# Altium schematic sheet Power.SchDoc
size A4; SheetNumber: 3; SheetTotal: 5
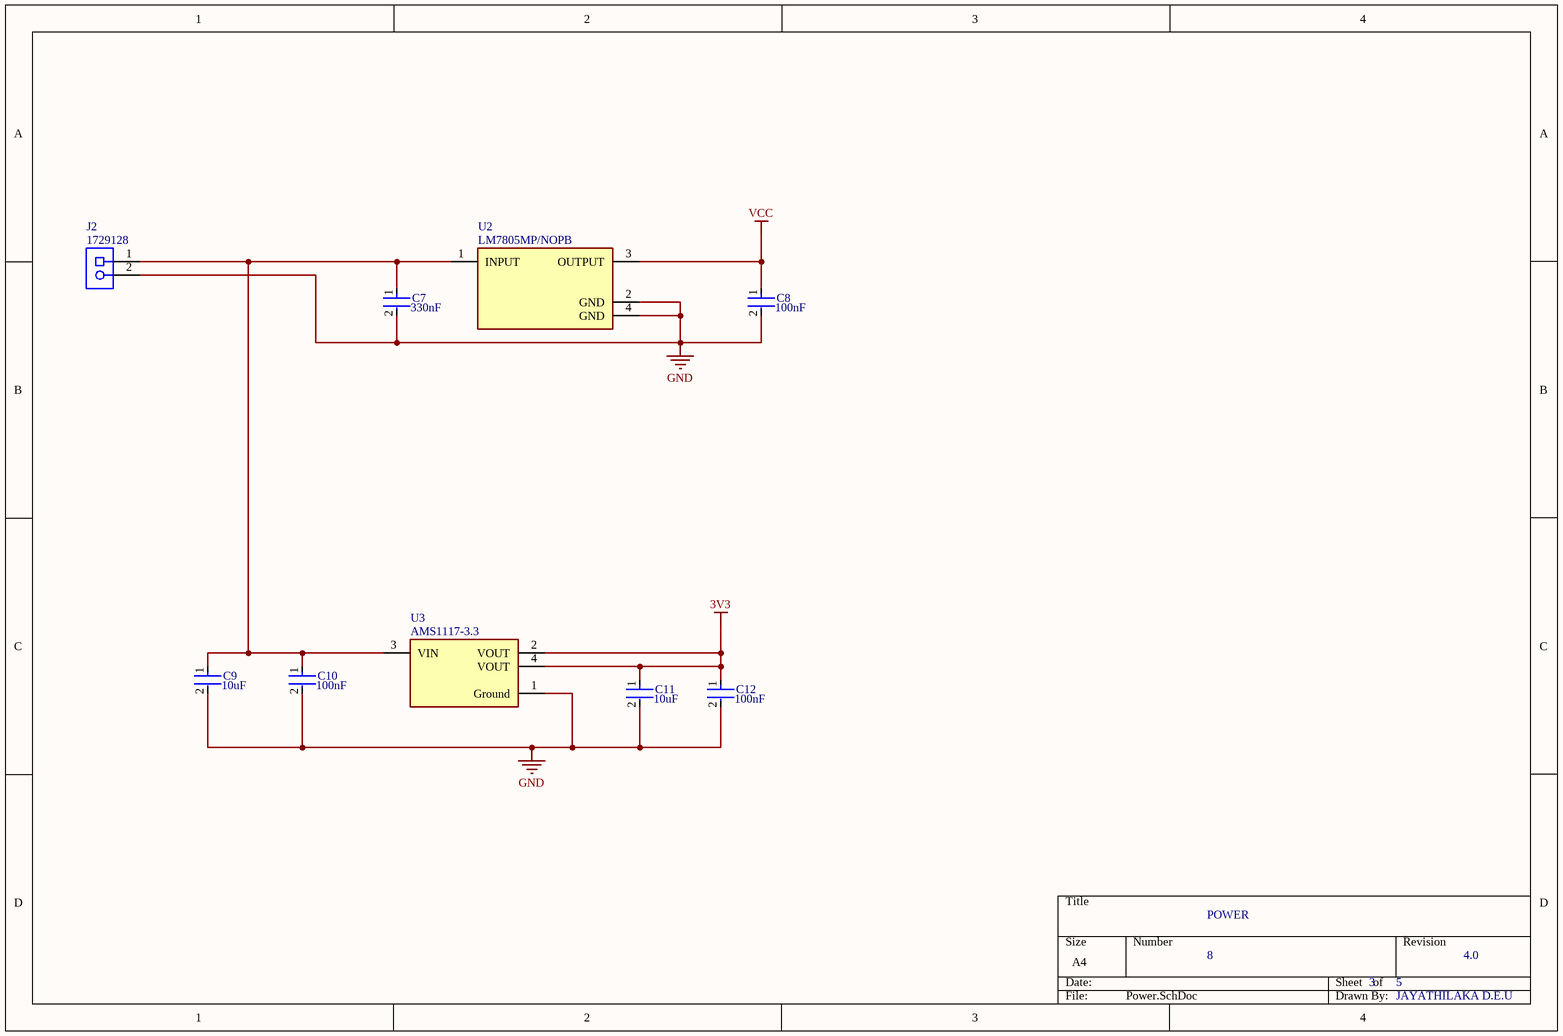
[diagram p0: Power.SchDoc]

## Parts
C7  value 330nF  [FP-CC1206-0_3-1_8-MFG]  (hidden comment: CC1206KKX7R0BB334)
C8  Capacitance: 100nF  [FP-GRM31C-0_2-e0_3_0_8-IPC_B]  (hidden comment: GRM31C5C1H104JA01L)
C9  value 10uF  [FP-CL31B106KBHNNNE-MFG]  (hidden comment: CL31B106KBHNNNE)
C10  Capacitance: 100nF  [FP-GRM31C-0_2-e0_3_0_8-IPC_B]  (hidden comment: GRM31C5C1H104JA01L)
C11  value 10uF  [FP-CL31B106KBHNNNE-MFG]  (hidden comment: CL31B106KBHNNNE)
C12  Capacitance: 100nF  [FP-GRM31C-0_2-e0_3_0_8-IPC_B]  (hidden comment: GRM31C5C1H104JA01L)
J2  1729128  [PHOE-1729128-2_V]
U2  LM7805MP/NOPB  [FP-DCY0004A-MFG]
U3  AMS1117-3.3  [FP-AMS1117-IPC_C]

## Nets
3V3: C11.1 C12.1 U3.2(VOUT) U3.4(VOUT)
GND: C7.2 C8.2 C9.2 C10.2 C11.2 C12.2 J2.2 U2.2(GND) U2.4(GND) U3.1(Ground)
VCC: C8.1 U2.3(OUTPUT)
NetC7_1: C7.1 C9.1 C10.1 J2.1 U2.1(INPUT) U3.3(VIN)

## Notes on the sheet
- POWER
- 8
- 3
- 5
- 4.0
- JAYATHILAKA D.E.U

## Library data of the parts
C7 = CMP-03422-001408-1: CAP CER X7R 1206; RoHS Compliant: Yes
C8 C10 C12 = CMP-06035-003994-1: Chip Multilayer Ceramic Capacitors for General Purpose, 1206, 0.10uF, C0G, 30ppm/°C, 5%, 50V; Voltage: 50V; Package Quantity: 1; Min Operating Temperature: -55°C; Termination: SMD/SMT; Voltage Rating (DC): 50V; Thickness: 0.071inch; Max Operating Temperature: 125°C; Mount: Surface Mount; Height: 1.6mm; Weight: 0.000571oz; Length: 3.2mm; Case Code (Imperial): 1206; Tolerance: 5%; Lead Free: Lead Free; Material: Ceramic; REACH SVHC: No SVHC; Depth: 1.6mm; Case/Package: 1206; Radiation Hardening: No; Temperature Coefficient: 30ppm/°C; Packaging: Tape and Reel; Case Code (Metric): 3216; Dielectric: C0G; Width: 0.063inch; Voltage Rating: 50V
C9 C11 = CMP-2000-07530-2: CAP CER 10UF 50V X7R 1206; Manufacturer: Samsung; Tolerance: 10%; Material: Ceramic; Temperature Coefficient: 15%; Temperature Characteristic: X7R; Digikey Description: CAP CER 10UF 50V X7R 1206; Device Class L1: Passive Components; Lead Free: Yes; Device Class L3: Ceramic Capacitors; Octopart: https://octopart.com/cl31b106kbhnnne-samsung-30507377; ComponentLink2URL: http://www.samsungsem.com/global/front/downloadcms.do?path=%2F%2Fglobal%2F%2Fsupport%2F%2Fproduct-search%2F%2Fmlcc%2F%2F__icsFiles%2F%2Fafieldfile%2F%2F2019%2F%2F06%2F%2F18&fileName=CL31B106KBHNNNE-19.pdf; Voltage Rating: 50V; Temperature Range Low: -55°C; RoHS: TRUE; Temperature: -55°C to +125°C; Category: Cap; ComponentLink2Description: Datasheet; Manufacturer Part Number: CL31B106KBHNNNE; Automotive: No; Device Class L2: Capacitors; Capacitance: 10uF; Height: 1.8mm; Temperature Range High: +125°C; Package: CL31B106KBHNNNE
J2 = CMP-2000-05815-1: PCB Terminal Block, 13.5 A, 400 V, 2-Pin THD, RoHS, Bulk; Manufacturer: Phoenix Contact; Package Version: 03/2015; No. of Rows: 1; Pitch: 5.08mm; No. of Positions: 2; Voltage Rating: 400V; Current Rating: 13500mA; Manufacturer URL: http://www.phoenixcontact.com/; Datasheet URL: https://datasheet.ciiva.com/16046/1729128-16046181.pdf; RoHS: TRUE; Package URL: https://www.phoenixcontact.com/online/portal/pi/pxc/product_detail_page/!ut/p/b1/3VdJjqNKFDxLH8AFycySyWY2ozFsEPOMMQaDOX1XedGL_1Vdm5YXJleknhSKeBkvI6EA8ncAo3AYoDhBQGco6KN7VURTdemj9us_IEKEZo_YHiPAEWEFmDGOHMORkqKYCORBZxgL7ZoaZYcbFFUZ3fqxSY6GOuxydWUuHqz1ynmMFygu583Bob0Ewr6Sd_l-5m-kAueHiB0jpRwZwe58wwtkpxtMYd_LmGcDRU02dRNEyWt6Y2ti5pSyJ_reIkzIulrqApdnbT11V5jnCKbYNCvhEM1MCpPByat_X379-iThf08CI5GfOPqfBeS3BRoBOdD55AKVv0iLwCMq-2BrzXWSGRH7pUGD9uwXQjiph3xL0DKQwdGa0JImiIOmBNOestqgwTHSSs2oOep-78apyXQBvNi8ZLaFjvjWvcaUEBu0MC6Wbe-d6mB0FAebo2lUWinqYaZs5DAYzV0RP9yitUjnGJ0iI9xhZkT42OCQNUJJhkgWINNQLP2JFP6OpMg3JCVg70jqHT0lvKOnhHf0lPuOnnLf0VPuWx6_dxwUIvwk5WMkT0kLL1mh61l2yZVSzG3pYV_bqo-mj6uMKwKwdnnW8Jh5RTOJzMOA5c-eJDaZQw4mTMPH02PvS_ZAqNVjVTo2WyYLkwH_KU1mmmG5kjRhDqPXLwwVHvVOjCM60-fpXvTDfMGW1PVFVS1r4e4yVDk4ZdNbkUHvqPqQSeian4UD39fNKmachqdJ1NJbyk8rXT9mXTvPk3oE5meulKGgiruPJek-4I9hTT6G8ZLOyRSm2RRVbThERQad5OS28hdt4YW4vG0stgYYzsWsK4_7y6DZMjJSCqri1kyiZR5vD7pwIrNR7QwPHTcLTI5qT7eRlpHrdGiupYlqQDJ7zy_CND8fWWBoLRXxk1RVcXiBQwbTD4Xi7KL-FuO94t9xaqweXzH; PartNumber: 1729128; Package Description: 2-Pin Through Hole Device, Body 8.1 x 10.16 mm, Pitch 5.08 mm; Datasheet Version: 12/2013; Mounting Technology: ThroughHole; Orientation: Horizontal; Package Reference: 1729128-2; Packing: Bulk
U2 = CMP-04917-000007-1: IC REG LINEAR 5V 1.5A SOT223-4; Manufacturer: Texas Instruments; Max Supply Voltage: 30V; Max Junction Temp: +150°C; Number Of Outputs: 1; Standoff Height: 0.02mm; Dropout Voltage: 2V; Accuracy Percentage: 3%; Nominal Supply Current: 8mA; Output Type: Fixed; Min Supply Voltage: 7.5V; Lead Free: Yes; Device Class L1: Integrated Circuits (ICs); Manufacturer Part Number: LM7805MP/NOPB; Package: DCY0004A; ComponentLink2Description: Datasheet; Temperature Range Low: 0°C; ComponentLink2URL: http://www.ti.com/lit/ds/symlink/lm7800.pdf; Height: 1.8mm; Temperature: 0°C to +125°C; Category: IC; Device Class L3: Voltage Regulators - Linear; Octopart: https://octopart.com/lm7805mp%2Fnopb-texas+instruments-74629991; Device Class L2: Power Management ICs; Output Voltage: 5V; RoHS: TRUE; Temperature Range High: +125°C; Automotive: No; Digikey Description: IC REG LINEAR 5V 1.5A SOT223-4; Output Current: 1.5A
U3 = CMP-209535-000001-1: LDO Voltage Regulators 1A, 3.3V; Manufacturer: Advanced Monolithic Systems; Dropout Voltage: 1.1V; Output Type: Fixed; Nominal Supply Current: 5mA; Max Power Dissipation: 1.2W; Max Supply Voltage: 15V; Number Of Outputs: 1; Standoff Height: 0.64mm; Max Junction Temp: +125°C; Height: 1.8mm; Package: AMS1117; Device Class L2: Power Management ICs; ComponentLink2Description: Datasheet; ComponentLink2URL: http://www.advanced-monolithic.com/pdf/ds1117.pdf; Category: IC; RoHS: TRUE; Automotive: No; Device Class L1: Integrated Circuits (ICs); Output Current: 1A; Device Class L3: Voltage Regulators - Linear; Temperature: -40°C to +125°C; Output Voltage: 3.3V; Manufacturer Part Number: AMS1117-3.3; Temperature Range Low: -40°C; Octopart: https://octopart.com/ams1117-3.3-advanced+monolithic+systems-25899300; Lead Free: Yes; Ipc Land Pattern Name: SOT229P700X180-4; Temperature Range High: +125°C